# Altium project lisa_mx_s.PrjPcb
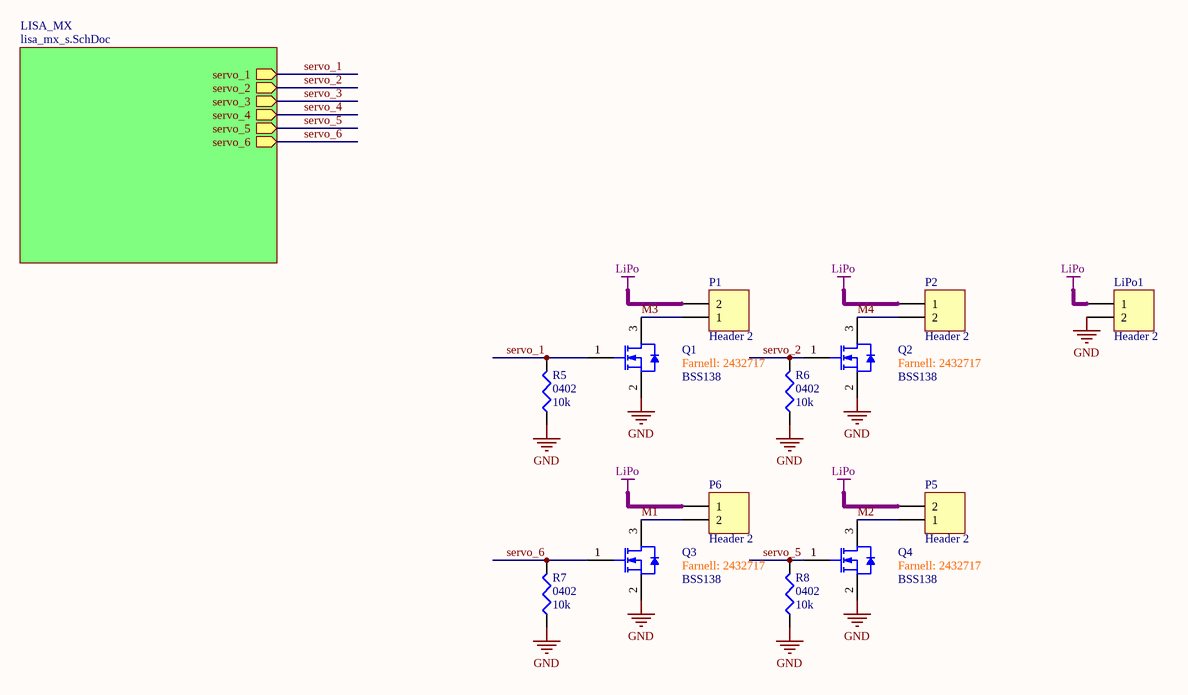
[diagram p0: lisa_mx_s_quad.SchDoc]
2 sheets, 67 parts. Net scope: hierarchical (ports join the sheet entries above them; power ports are global).
Board files: lisa_mx_s.PcbDoc, lisa_mx_s_quad.PcbDoc
Sheets:
  lisa_mx_s_quad.SchDoc
    LISA_MX = lisa_mx_s.SchDoc

## Sheet lisa_mx_s_quad.SchDoc
size A4

### Parts
LiPo1  Header 2  [PICOBLADE_53047-0210]
P1  Header 2  [PICOBLADE_53047-0210]
P2  Header 2  [PICOBLADE_53047-0210]
P5  Header 2  [PICOBLADE_53047-0210]
P6  Header 2  [PICOBLADE_53047-0210]
Q1  value BSS138  Farnell: 2432717  [SOT23A_CDW]  (hidden comment: N-FET)
Q2  value BSS138  Farnell: 2432717  [SOT23A_CDW]  (hidden comment: N-FET)
Q3  value BSS138  Farnell: 2432717  [SOT23A_CDW]  (hidden comment: N-FET)
Q4  value BSS138  Farnell: 2432717  [SOT23A_CDW]  (hidden comment: N-FET)
R5  0402  value 10k  [V0402RES]
R6  0402  value 10k  [V0402RES]
R7  0402  value 10k  [V0402RES]
R8  0402  value 10k  [V0402RES]

### Sub-sheets
LISA_MX = lisa_mx_s.SchDoc: servo_1 (out), servo_2 (out), servo_3 (out), servo_4 (out), servo_5 (out), servo_6 (out)

### Nets
GND: LiPo1.2 Q1.2(S) Q2.2(S) Q3.2(S) Q4.2(S) R5.1 R6.1 R7.1 R8.1
LiPo: LiPo1.1 P1.2 P2.1 P5.2 P6.1
M1: P6.2 Q3.3(D)
M2: P5.1 Q4.3(D)
M3: P1.1 Q1.3(D)
M4: P2.2 Q2.3(D)
servo_1: Q1.1(G) R5.2 ; sheet LISA_MX/servo_1
servo_2: Q2.1(G) R6.2 ; sheet LISA_MX/servo_2
servo_5: Q4.1(G) R8.2 ; sheet LISA_MX/servo_5
servo_6: Q3.1(G) R7.2 ; sheet LISA_MX/servo_6

### Library data of the parts
LiPo1 P1 P2 P5 P6 = Header 2: Header, 2-Pin
Q1-Q4 = BSS138: Case: SOT23A
R5-R8 = Res3: Resistor; Case: 0402; farnell: 9241000

## Sheet lisa_mx_s.SchDoc
size A3
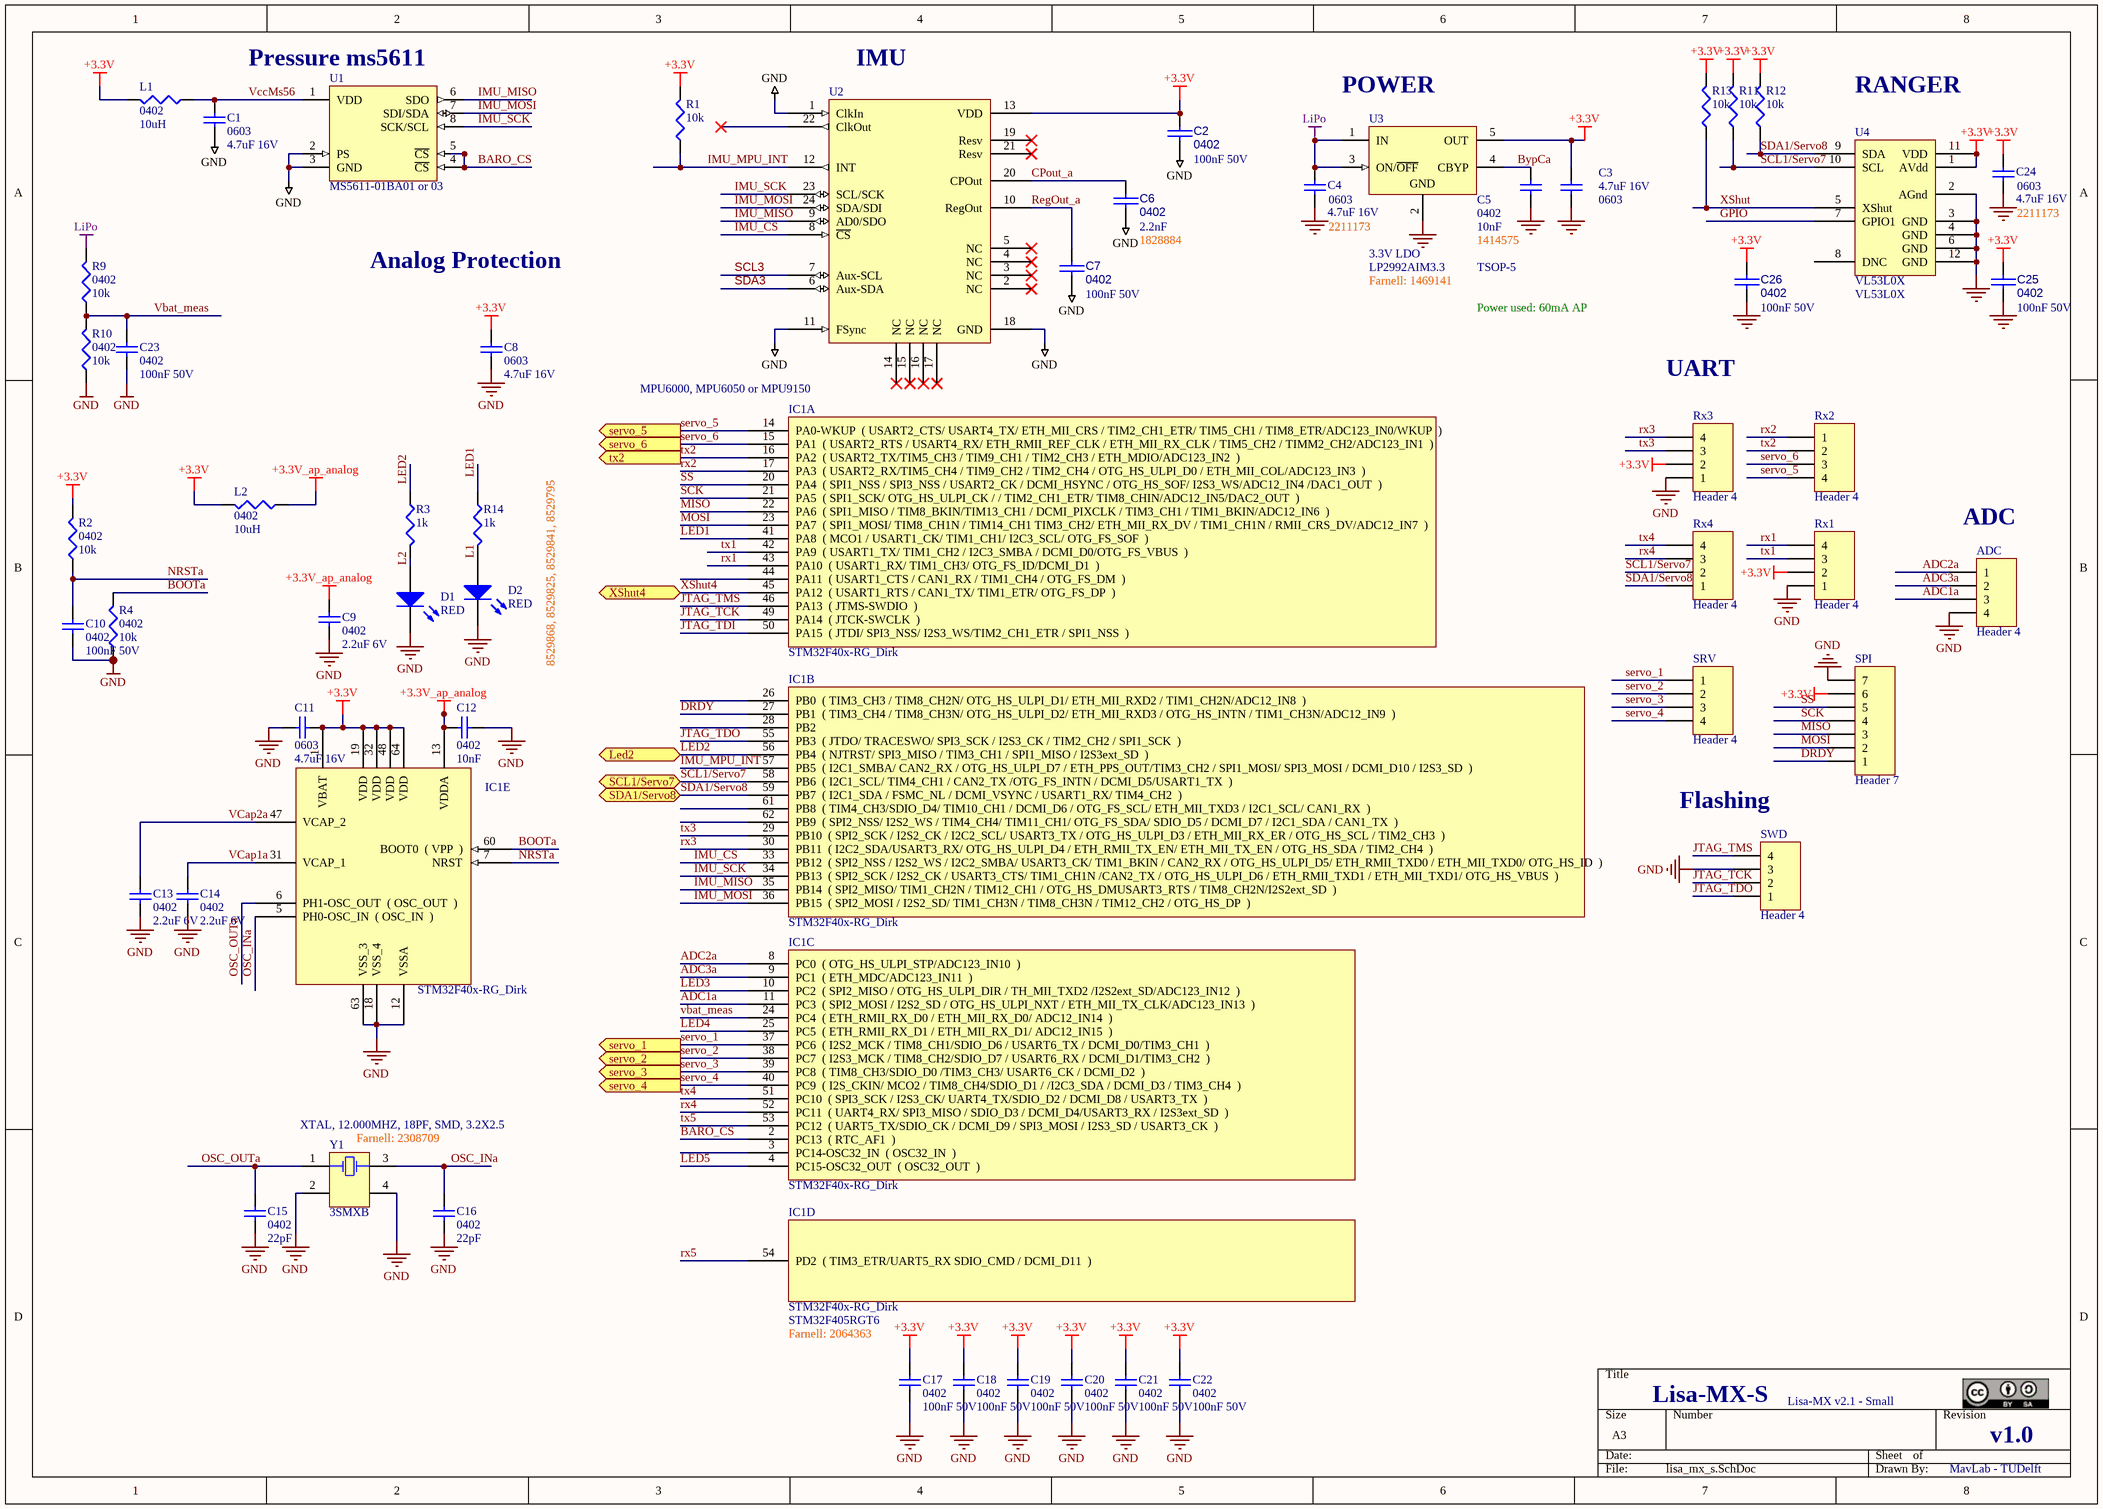
[diagram p1: lisa_mx_s.SchDoc]

### Parts
ADC  Header 4  [4pin1mmpitch]  (no BOM)
C1  0603  value 4.7uF 16V  [V0603]
C2  0402  value 100nF 50V  [V0402]
C3  value 4.7uF 16V  [V0603]  (hidden comment: 0603)
C4  value 4.7uF 16V  Farnell: 2211173  [V0603]  (hidden comment: 0603)
C5  value 10nF  Farnell: 1414575  [V0402]  (hidden comment: 0402)
C6  0402  value 2.2nF  farnell: 1828884  [V0402]
C7  0402  value 100nF 50V  [V0402]
C8  0603  value 4.7uF 16V  [V0603]
C9  0402  value 2.2uF 6V  [V0402]
C10  0402  value 100nF 50V  [V0402]
C11  0603  value 4.7uF 16V  [V0603]
C12  0402  value 10nF  [V0402]
C13  0402  value 2.2uF 6V  [V0402]
C14  0402  value 2.2uF 6V  [V0402]
C15  0402  value 22pF  [V0402]
C16  0402  value 22pF  [V0402]
C17  0402  value 100nF 50V  [V0402]
C18  0402  value 100nF 50V  [V0402]
C19  0402  value 100nF 50V  [V0402]
C20  0402  value 100nF 50V  [V0402]
C21  0402  value 100nF 50V  [V0402]
C22  0402  value 100nF 50V  [V0402]
C23  0402  value 100nF 50V  [V0402]
C24  value 4.7uF 16V  Farnell: 2211173  [V0603]  (hidden comment: 0603)
C25  0402  value 100nF 50V  [V0402]
C26  0402  value 100nF 50V  [V0402]
D1  RED  [KP-1608SURC_R]
D2  RED  [KP-1608SURC_R]
IC1  STM32F40x-RG_Dirk  [LQFP64]  (parts A,B,C,D,E of 5)
L1  0402  value 10uH  [V0402RES]
L2  0402  value 10uH  [V0402RES]
R1  value 10k  [V0402RES]  (hidden comment: 0402)
R2  0402  value 10k  [V0402RES]
R3  value 1k  [V0402RES]  (hidden comment: 0402)
R4  0402  value 10k  [V0402RES]
R9  0402  value 10k  [V0402RES]
R10  0402  value 10k  [V0402RES]
R11  value 10k  [V0402RES]  (hidden comment: 0402)
R12  value 10k  [V0402RES]  (hidden comment: 0402)
R13  value 10k  [V0402RES]  (hidden comment: 0402)
R14  value 1k  [V0402RES]  (hidden comment: 0402)
Rx1  Header 4  [PICOBLADE_53047-0410]  (no BOM)
Rx2  Header 4  [PICOBLADE_53047-0410]  (no BOM)
Rx3  Header 4  [PICOBLADE_53047-0410]  (no BOM)
Rx4  Header 4  [PICOBLADE_53047-0410]  (no BOM)
SPI  Header 7  [PICOBLADE_53047-0710]  (no BOM)
SRV  Header 4  [PICOBLADE_53047-0410]  (no BOM)
SWD  Header 4  [PICOBLADE_53047-0410]  (no BOM)
U1  MS5611-01BA01 or 03  [MS5611-01BA]
U2  MPU6000, MPU6050 or MPU9150  [mpu60X0]
U3  3.3V LDO  value LP2992AIM3.3  Case: TSOP-5  Farnell: 1469141  [SOT-23-OT5_N]
U4  VL53L0X  [VL53L0Xtra]
Y1  3SMXB  value XTAL, 12.000MHZ, 18PF, SMD, 3.2X2.5  Farnell: 2308709  [CFPX-5]

### Ports
Led2, SCL1/Servo7, SDA1/Servo8, servo_1 (out), servo_2 (out), servo_3 (out), servo_4 (out), servo_5 (out), servo_6 (out), tx2 (out), XShut4

### Nets
+3.3V: C2.1 C3.2 C8.2 C11.1 C17.2 C18.2 C19.2 C20.2 C21.2 C22.2 C24.2 C25.1 C26.1 IC1.1(VBAT) IC1.19(VDD) IC1.32(VDD) IC1.48(VDD) IC1.64(VDD) L1.1 L2.1 R1.2 R2.2 R11.2 R12.2 R13.2 Rx1.2 Rx3.2 SPI.6 U2.13(VDD) U3.5(OUT) U4.1(AVdd) U4.11(VDD)
+3.3V_ap_analog: C9.2 C12.2 IC1.13(VDDA) L2.2
GND: ADC.4 C1.1 C2.2 C3.1 C4.1 C5.1 C6.2 C7.2 C8.1 C9.1 C10.1 C11.2 C12.1 C13.1 C14.1 C15.1 C16.2 C17.1 C18.1 C19.1 C20.1 C21.1 C22.1 C23.1 C24.1 C25.2 C26.2 D1.2(K) D2.2(K) IC1.12(VSSA) IC1.18(VSS_4) IC1.63(VSS_3) R4.1 R10.1 Rx1.1 Rx3.1 SPI.7 SWD.3 U1.2(PS) U1.3(GND) U2.1(ClkIn) U2.11(FSync) U2.18(GND) U3.2(GND) U4.2(AGnd) U4.3(GND) U4.4(GND) U4.6(GND) U4.12(GND) Y1.2(NC) Y1.4(NC)
LiPo: C4.2 R9.2 U3.1(IN) U3.3(ON/~{OFF})
ADC1a: ADC.3 IC1.11(PC3__(_SPI2_MOSI_/_I2S2_SD_/_OTG_HS_ULPI_NXT_/_ETH_MII_TX_CLK/ADC123_IN13__))
ADC2a: ADC.1 IC1.8(PC0__(_OTG_HS_ULPI_STP/ADC123_IN10__))
ADC3a: ADC.2 IC1.9(PC1__(_ETH_MDC/ADC123_IN11__))
BARO_CS: IC1.2(PC13__(_RTC_AF1__)) U1.4(~{CS}) U1.5(~{CS})
BOOTa: IC1.60(BOOT0__(_VPP__)) R4.2
BypCa: C5.2 U3.4(CBYP)
CPout_a: C6.1 U2.20(CPOut)
DRDY: IC1.27(PB1__(_TIM3_CH4_/_TIM8_CH3N/_OTG_HS_ULPI_D2/_ETH_MII_RXD3_/_OTG_HS_INTN_/_TIM1_CH3N/ADC12_IN9__)) SPI.1
GPIO: U4.7(GPIO1)
IMU_CS: IC1.33(PB12__(_SPI2_NSS_/_I2S2_WS_/_I2C2_SMBA/_USART3_CK/_TIM1_BKIN_/_CAN2_RX_/_OTG_HS_ULPI_D5/_ETH_RMII_TXD0_/_ETH_MII_TXD0/_OTG_HS_ID__)) U2.8(~{CS})
IMU_MISO: IC1.35(PB14__(_SPI2_MISO/_TIM1_CH2N_/_TIM12_CH1_/_OTG_HS_DMUSART3_RTS_/_TIM8_CH2N/I2S2ext_SD__)) U1.6(SDO) U2.9(AD0/SDO)
IMU_MOSI: IC1.36(PB15__(_SPI2_MOSI_/_I2S2_SD/_TIM1_CH3N_/_TIM8_CH3N_/_TIM12_CH2_/_OTG_HS_DP__)) U1.7(SDI/SDA) U2.24(SDA/SDI)
IMU_MPU_INT: IC1.57(PB5__(_I2C1_SMBA/_CAN2_RX_/_OTG_HS_ULPI_D7_/_ETH_PPS_OUT/TIM3_CH2_/_SPI1_MOSI/_SPI3_MOSI_/_DCMI_D10_/_I2S3_SD__)) R1.1 U2.12(INT)
IMU_SCK: IC1.34(PB13__(_SPI2_SCK_/_I2S2_CK_/_USART3_CTS/_TIM1_CH1N_/CAN2_TX_/_OTG_HS_ULPI_D6_/_ETH_RMII_TXD1_/_ETH_MII_TXD1/_OTG_HS_VBUS__)) U1.8(SCK/SCL) U2.23(SCL/SCK)
JTAG_TCK: IC1.49(PA14__(_JTCK-SWCLK__)) SWD.2
JTAG_TDI: IC1.50(PA15__(_JTDI/_SPI3_NSS/_I2S3_WS/TIM2_CH1_ETR_/_SPI1_NSS__))
JTAG_TDO: IC1.55(PB3__(_JTDO/_TRACESWO/_SPI3_SCK_/_I2S3_CK_/_TIM2_CH2_/_SPI1_SCK__)) SWD.1
JTAG_TMS: IC1.46(PA13__(_JTMS-SWDIO__)) SWD.4
L1: D2.1(A) R14.2
L2: D1.1(A) R3.2
LED1: IC1.41(PA8__(_MCO1_/_USART1_CK/_TIM1_CH1/_I2C3_SCL/_OTG_FS_SOF__)) R14.1
LED2: IC1.56(PB4__(_NJTRST/_SPI3_MISO_/_TIM3_CH1_/_SPI1_MISO_/_I2S3ext_SD__)) R3.1 ; port Led2
LED3: IC1.10(PC2__(_SPI2_MISO_/_OTG_HS_ULPI_DIR_/_TH_MII_TXD2_/I2S2ext_SD/ADC123_IN12__))
LED4: IC1.25(PC5__(_ETH_RMII_RX_D1_/_ETH_MII_RX_D1/_ADC12_IN15__))
LED5: IC1.4(PC15-OSC32_OUT__(_OSC32_OUT__))
MISO: IC1.22(PA6__(_SPI1_MISO_/_TIM8_BKIN/TIM13_CH1_/_DCMI_PIXCLK_/_TIM3_CH1_/_TIM1_BKIN/ADC12_IN6__)) SPI.3
MOSI: IC1.23(PA7__(_SPI1_MOSI/_TIM8_CH1N_/_TIM14_CH1_TIM3_CH2/_ETH_MII_RX_DV_/_TIM1_CH1N_/_RMII_CRS_DV/ADC12_IN7__)) SPI.2
NRSTa: C10.2 IC1.7(NRST) R2.1
OSC_INa: C16.1 IC1.5(PH0-OSC_IN__(_OSC_IN__)) Y1.3(OSC2)
OSC_OUTa: C15.2 IC1.6(PH1-OSC_OUT__(_OSC_OUT__)) Y1.1(OSC1)
RegOut_a: C7.1 U2.10(RegOut)
rx1: IC1.43(PA10__(_USART1_RX/_TIM1_CH3/_OTG_FS_ID/DCMI_D1__)) Rx1.4
rx2: IC1.17(PA3__(_USART2_RX/TIM5_CH4_/_TIM9_CH2_/_TIM2_CH4_/_OTG_HS_ULPI_D0_/_ETH_MII_COL/ADC123_IN3__)) Rx2.1
rx3: IC1.30(PB11__(_I2C2_SDA/USART3_RX/_OTG_HS_ULPI_D4_/_ETH_RMII_TX_EN/_ETH_MII_TX_EN_/_OTG_HS_SDA_/_TIM2_CH4__)) Rx3.4
rx4: IC1.52(PC11__(_UART4_RX/_SPI3_MISO_/_SDIO_D3_/_DCMI_D4/USART3_RX_/_I2S3ext_SD__)) Rx4.3
rx5: IC1.54(PD2__(_TIM3_ETR/UART5_RX_SDIO_CMD_/_DCMI_D11__))
SCK: IC1.21(PA5__(_SPI1_SCK/_OTG_HS_ULPI_CK_/_/_TIM2_CH1_ETR/_TIM8_CHIN/ADC12_IN5/DAC2_OUT__)) SPI.4
SCL1/Servo7: IC1.58(PB6__(_I2C1_SCL/_TIM4_CH1_/_CAN2_TX_/OTG_FS_INTN_/_DCMI_D5/USART1_TX__)) R11.1 Rx4.2 U4.10(SCL) ; port SCL1/Servo7
SCL3: U2.7(Aux-SCL)
SDA1/Servo8: IC1.59(PB7__(_I2C1_SDA_/_FSMC_NL_/_DCMI_VSYNC_/_USART1_RX/_TIM4_CH2__)) R12.1 Rx4.1 U4.9(SDA) ; port SDA1/Servo8
SDA3: U2.6(Aux-SDA)
servo_1: IC1.37(PC6__(_I2S2_MCK_/_TIM8_CH1/SDIO_D6_/_USART6_TX_/_DCMI_D0/TIM3_CH1__)) SRV.1 ; port servo_1
servo_2: IC1.38(PC7__(_I2S3_MCK_/_TIM8_CH2/SDIO_D7_/_USART6_RX_/_DCMI_D1/TIM3_CH2__)) SRV.2 ; port servo_2
servo_3: IC1.39(PC8__(_TIM8_CH3/SDIO_D0_/TIM3_CH3/_USART6_CK_/_DCMI_D2__)) SRV.3 ; port servo_3
servo_4: IC1.40(PC9__(_I2S_CKIN/_MCO2_/_TIM8_CH4/SDIO_D1_/_/I2C3_SDA_/_DCMI_D3_/_TIM3_CH4__)) SRV.4 ; port servo_4
servo_5: IC1.14(PA0-WKUP__(_USART2_CTS/_USART4_TX/_ETH_MII_CRS_/_TIM2_CH1_ETR/_TIM5_CH1_/_TIM8_ETR/ADC123_IN0/WKUP__)) Rx2.4 ; port servo_5
servo_6: IC1.15(PA1__(_USART2_RTS_/_USART4_RX/_ETH_RMII_REF_CLK_/_ETH_MII_RX_CLK_/_TIM5_CH2_/_TIMM2_CH2/ADC123_IN1__)) Rx2.3 ; port servo_6
SS: IC1.20(PA4__(_SPI1_NSS_/_SPI3_NSS_/_USART2_CK_/_DCMI_HSYNC_/_OTG_HS_SOF/_I2S3_WS/ADC12_IN4_/DAC1_OUT__)) SPI.5
tx1: IC1.42(PA9__(_USART1_TX/_TIM1_CH2_/_I2C3_SMBA_/_DCMI_D0/OTG_FS_VBUS__)) Rx1.3
tx2: IC1.16(PA2__(_USART2_TX/TIM5_CH3_/_TIM9_CH1_/_TIM2_CH3_/_ETH_MDIO/ADC123_IN2__)) Rx2.2 ; port tx2
tx3: IC1.29(PB10__(_SPI2_SCK_/_I2S2_CK_/_I2C2_SCL/_USART3_TX_/_OTG_HS_ULPI_D3_/_ETH_MII_RX_ER_/_OTG_HS_SCL_/_TIM2_CH3__)) Rx3.3
tx4: IC1.51(PC10__(_SPI3_SCK_/_I2S3_CK/_UART4_TX/SDIO_D2_/_DCMI_D8_/_USART3_TX__)) Rx4.4
tx5: IC1.53(PC12__(_UART5_TX/SDIO_CK_/_DCMI_D9_/_SPI3_MOSI_/_I2S3_SD_/_USART3_CK__))
vbat_meas: C23.2 IC1.24(PC4__(_ETH_RMII_RX_D0_/_ETH_MII_RX_D0/_ADC12_IN14__)) R9.1 R10.2
VCap1a: C14.2 IC1.31(VCAP_1)
VCap2a: C13.2 IC1.47(VCAP_2)
VccMs56: C1.2 L1.2 U1.1(VDD)
XShut: R13.1 U4.5(XShut)
XShut4: IC1.45(PA12__(_USART1_RTS_/_CAN1_TX/_TIM1_ETR/_OTG_FS_DP__)) ; port XShut4

Not connected (* = marked no-connect by the designer): IC1 3(PC14-OSC32_IN__(_OSC32_IN__)) 26(PB0__(_TIM3_CH3_/_TIM8_CH2N/_OTG_HS_ULPI_D1/_ETH_MII_RXD2_/_TIM1_CH2N/ADC12_IN8__)) 28(PB2) 44(PA11__(_USART1_CTS_/_CAN1_RX_/_TIM1_CH4_/_OTG_FS_DM__)) 61(PB8__(_TIM4_CH3/SDIO_D4/_TIM10_CH1_/_DCMI_D6_/_OTG_FS_SCL/_ETH_MII_TXD3_/_I2C1_SCL/_CAN1_RX__)) 62(PB9__(_SPI2_NSS/_I2S2_WS_/_TIM4_CH4/_TIM11_CH1/_OTG_FS_SDA/_SDIO_D5_/_DCMI_D7_/_I2C1_SDA_/_CAN1_TX__)); U2 2(NC)* 3(NC)* 4(NC)* 5(NC)* 14(NC)* 15(NC)* 16(NC)* 17(NC)* 19(Resv)* 21(Resv)* 22(ClkOut)*; U4 8(DNC)

### Notes on the sheet
- (near U1) Pressure ms5611
- (near U2) IMU
- (near U3) POWER
- RANGER
- Analog Protection
- Power used: 60mA AP
- UART
- (near ADC) ADC
- 8529868, 8529825, 8529841, 8529795
- (near SWD) Flashing
- Lisa-MX-S
- Lisa-MX v2.1 - Small
- v1.0
- MavLab - TUDelft

### Library data of the parts
ADC Rx1-Rx4 SRV SWD = Header 4: Header, 4-Pin
C1 C5 C8-C23 = Cap: Capacitor
  C1 C8 C11: Case: 0603; farnell: 2211173
  C5: Case: 0402
  C9 C13 C14: Case: 0402; farnell: 2118127
  C10 C17-C23: Case: 0402; farnell: 2210822
  C12: Case: 0402; farnell: 1414575
  C15 C16: Case: 0402; farnell: 2496799
C2 C6 C7 C25 C26 = CAP: Capacitor; Case: 0402
  C2 C7 C25 C26: farnell: 2210822
C3 C4 C24 = K0603_100nF_50V_X7R: Capacitor; Case: 0603
  C3: farnell: 2211173
D1 D2 = LED2: Typical RED, GREEN, YELLOW, AMBER GaAs LED; value: Led Red 0603; Case: 0603; farnell: ?
IC1 = STM32F40x-RG_Dirk: Value: STM32F405RGT6; Case: LQFP64; farnell: 2064363
L1 L2 = Res3: FERRITE BEAD, 1OHM, 100MA, 0402; Case: 0402; farnell: 1669675
R1-R4 R9-R14 = Res3: Resistor; Case: 0402
  R1 R2 R4 R9-R13: farnell: 9241000
  R3 R14: farnell: 9335757
SPI = Header 7: Header, 7-Pin
U1 = MS5611-01BA01: MS5611-01BA01 High Resolution Barometer Module; Value: MS5611-01BA01; farnell: 2362662
U2 = MPU6000: INVENSENSE Integrated Dual Axis Gyroscope; Value: MPU6000, MPU6050 or MPU9150; farnell: 1862383
U3 = LP2992AIM5-5.0: Micropower 250 mA Low-Noise Ultra Low-Dropout Regulator in SOT-23 and LLP Packages
Y1 = 3SMXB: Surface Mount Quartz Crystal; Case: CFPX-5
U4 = VL53L0X: value: VL53L0X

## Nets that join several sheets
GND: lisa_mx_s_quad (9 pins), lisa_mx_s (51 pins)
LiPo: lisa_mx_s_quad (5 pins), lisa_mx_s (C4.2 R9.2 U3.1 U3.3)
servo_1: lisa_mx_s_quad (Q1.1 R5.2), lisa_mx_s (IC1.37 SRV.1)
servo_2: lisa_mx_s_quad (Q2.1 R6.2), lisa_mx_s (IC1.38 SRV.2)
servo_5: lisa_mx_s_quad (Q4.1 R8.2), lisa_mx_s (IC1.14 Rx2.4)
servo_6: lisa_mx_s_quad (Q3.1 R7.2), lisa_mx_s (IC1.15 Rx2.3)